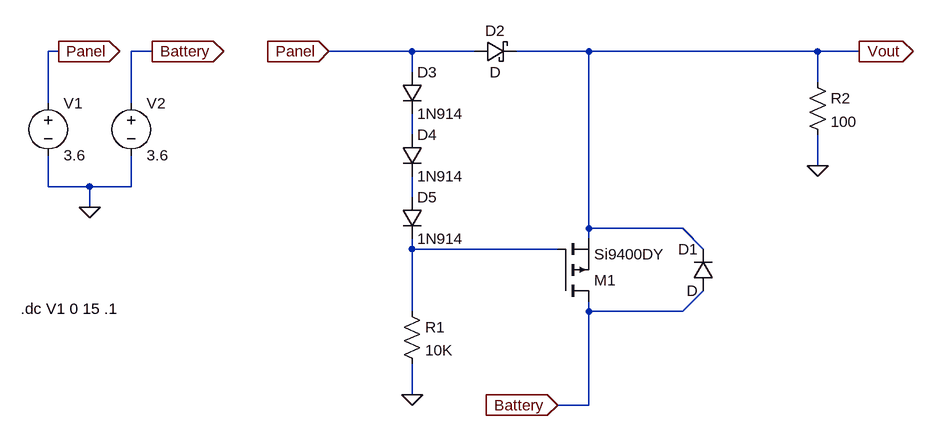
[diagram p0: schematic Power swich circuit.asc]
Power swich circuit.asc, the LTspice schematic file:
Version 4
SHEET 1 880 680
WIRE -560 -864 -576 -864
WIRE -416 -864 -448 -864
WIRE -16 -864 -144 -864
WIRE 80 -864 -16 -864
WIRE 256 -864 144 -864
WIRE 608 -864 256 -864
WIRE 672 -864 608 -864
WIRE -16 -832 -16 -864
WIRE 608 -816 608 -864
WIRE -576 -784 -576 -864
WIRE -448 -784 -448 -864
WIRE -16 -736 -16 -768
WIRE 608 -688 608 -736
WIRE -576 -656 -576 -704
WIRE -512 -656 -576 -656
WIRE -448 -656 -448 -704
WIRE -448 -656 -512 -656
WIRE -16 -640 -16 -672
WIRE -512 -624 -512 -656
WIRE 256 -592 256 -864
WIRE 400 -592 256 -592
WIRE 256 -576 256 -592
WIRE -16 -560 -16 -576
WIRE 208 -560 -16 -560
WIRE 432 -560 400 -592
WIRE -16 -464 -16 -560
WIRE 256 -464 256 -480
WIRE 400 -464 432 -496
WIRE 400 -464 256 -464
WIRE -16 -336 -16 -384
WIRE 256 -320 256 -464
WIRE 256 -320 208 -320
FLAG -16 -336 0
FLAG 672 -864 Vout
IOPIN 672 -864 Out
FLAG -144 -864 Panel
IOPIN -144 -864 In
FLAG 208 -320 Battery
IOPIN 208 -320 In
FLAG -512 -624 0
FLAG -560 -864 Panel
IOPIN -560 -864 Out
FLAG -416 -864 Battery
IOPIN -416 -864 Out
FLAG 608 -688 0
SYMBOL diode 448 -496 R180
WINDOW 0 24 64 Left 2
WINDOW 3 24 0 Left 2
SYMATTR InstName D1
SYMBOL pmos 208 -480 M180
SYMATTR InstName M1
SYMATTR Value Si9400DY
SYMBOL schottky 80 -848 R270
WINDOW 0 32 32 VTop 2
WINDOW 3 0 32 VBottom 2
SYMATTR InstName D2
SYMBOL res -32 -480 R0
SYMATTR InstName R1
SYMATTR Value 10K
SYMBOL voltage -576 -800 R0
WINDOW 123 0 0 Left 0
WINDOW 39 0 0 Left 0
SYMATTR InstName V1
SYMATTR Value 3.6
SYMBOL voltage -448 -800 R0
WINDOW 123 0 0 Left 0
WINDOW 39 0 0 Left 0
SYMATTR InstName V2
SYMATTR Value 3.6
SYMBOL res 592 -832 R0
SYMATTR InstName R2
SYMATTR Value 100
SYMBOL diode -32 -832 R0
SYMATTR InstName D3
SYMATTR Value 1N914
SYMBOL diode -32 -736 R0
SYMATTR InstName D4
SYMATTR Value 1N914
SYMBOL diode -32 -640 R0
SYMATTR InstName D5
SYMATTR Value 1N914
TEXT -618 -468 Left 2 !.dc V1 0 15 .1

The netlist it stands for:
* Power swich circuit.asc
D1 Battery Vout D
M1 Battery N003 Vout Vout Si9400DY
D2 Panel Vout D
R1 N003 0 10K
V1 Panel 0 3.6
V2 Battery 0 3.6
R2 Vout 0 100
D3 Panel N001 1N914
D4 N001 N002 1N914
D5 N002 N003 1N914
.model D D
.lib standard.dio
.model NMOS NMOS
.model PMOS PMOS
.lib standard.mos
.dc V1 0 15 .1
.backanno
.end

* Results of the author's LTspice run, read from the files saved beside the schematic
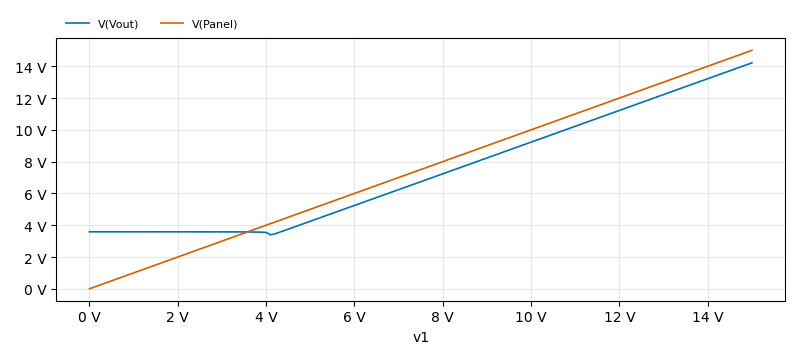
[diagram p1: DC transfer characteristic of Power swich circuit.asc, plotted from the saved traces]
* DC transfer characteristic, 1 run:
*   V(Vout): 3.587 V at v1=0 V, 14.21 V at v1=15 V, min 3.397 V, max 14.21 V
*   V(Panel): 0 V at v1=0 V, 15 V at v1=15 V, min 0 V, max 15 V